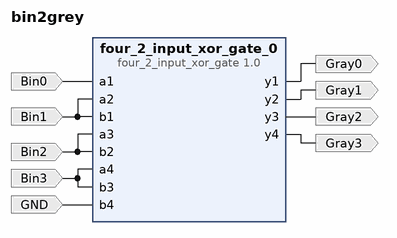
[diagram p0: block diagram of the top level]
# Vivado block design bin2grey, xc7a35tcpg236-1, Vivado 2018.2
create_bd_design bin2grey

create_bd_port -dir I Bin0
create_bd_port -dir I Bin2
create_bd_port -dir I Bin1
create_bd_port -dir I Bin3
create_bd_port -dir O Gray0
create_bd_port -dir O Gray1
create_bd_port -dir O Gray2
create_bd_port -dir O Gray3
create_bd_port -dir I GND

create_bd_cell -type ip -vlnv xilinx.com:XUP:four_2_input_xor_gate:1.0 four_2_input_xor_gate_0

# ---- connections ----

connect_bd_net -net Bin0_1 [get_bd_ports Bin0] [get_bd_pins four_2_input_xor_gate_0/a1]
connect_bd_net -net Bin1_1 [get_bd_ports Bin1] [get_bd_pins four_2_input_xor_gate_0/b1] [get_bd_pins four_2_input_xor_gate_0/a2]
connect_bd_net -net Bin2_1 [get_bd_ports Bin2] [get_bd_pins four_2_input_xor_gate_0/b2] [get_bd_pins four_2_input_xor_gate_0/a3]
connect_bd_net -net Bin3_1 [get_bd_ports Bin3] [get_bd_pins four_2_input_xor_gate_0/b3] [get_bd_pins four_2_input_xor_gate_0/a4]
connect_bd_net [get_bd_ports GND] [get_bd_pins four_2_input_xor_gate_0/b4]
connect_bd_net [get_bd_pins four_2_input_xor_gate_0/y1] [get_bd_ports Gray0]
connect_bd_net [get_bd_pins four_2_input_xor_gate_0/y2] [get_bd_ports Gray1]
connect_bd_net [get_bd_pins four_2_input_xor_gate_0/y3] [get_bd_ports Gray2]
connect_bd_net [get_bd_pins four_2_input_xor_gate_0/y4] [get_bd_ports Gray3]

validate_bd_design
save_bd_design
